# EAGLE design ATmega324 code loader (EAGLE 5.06)
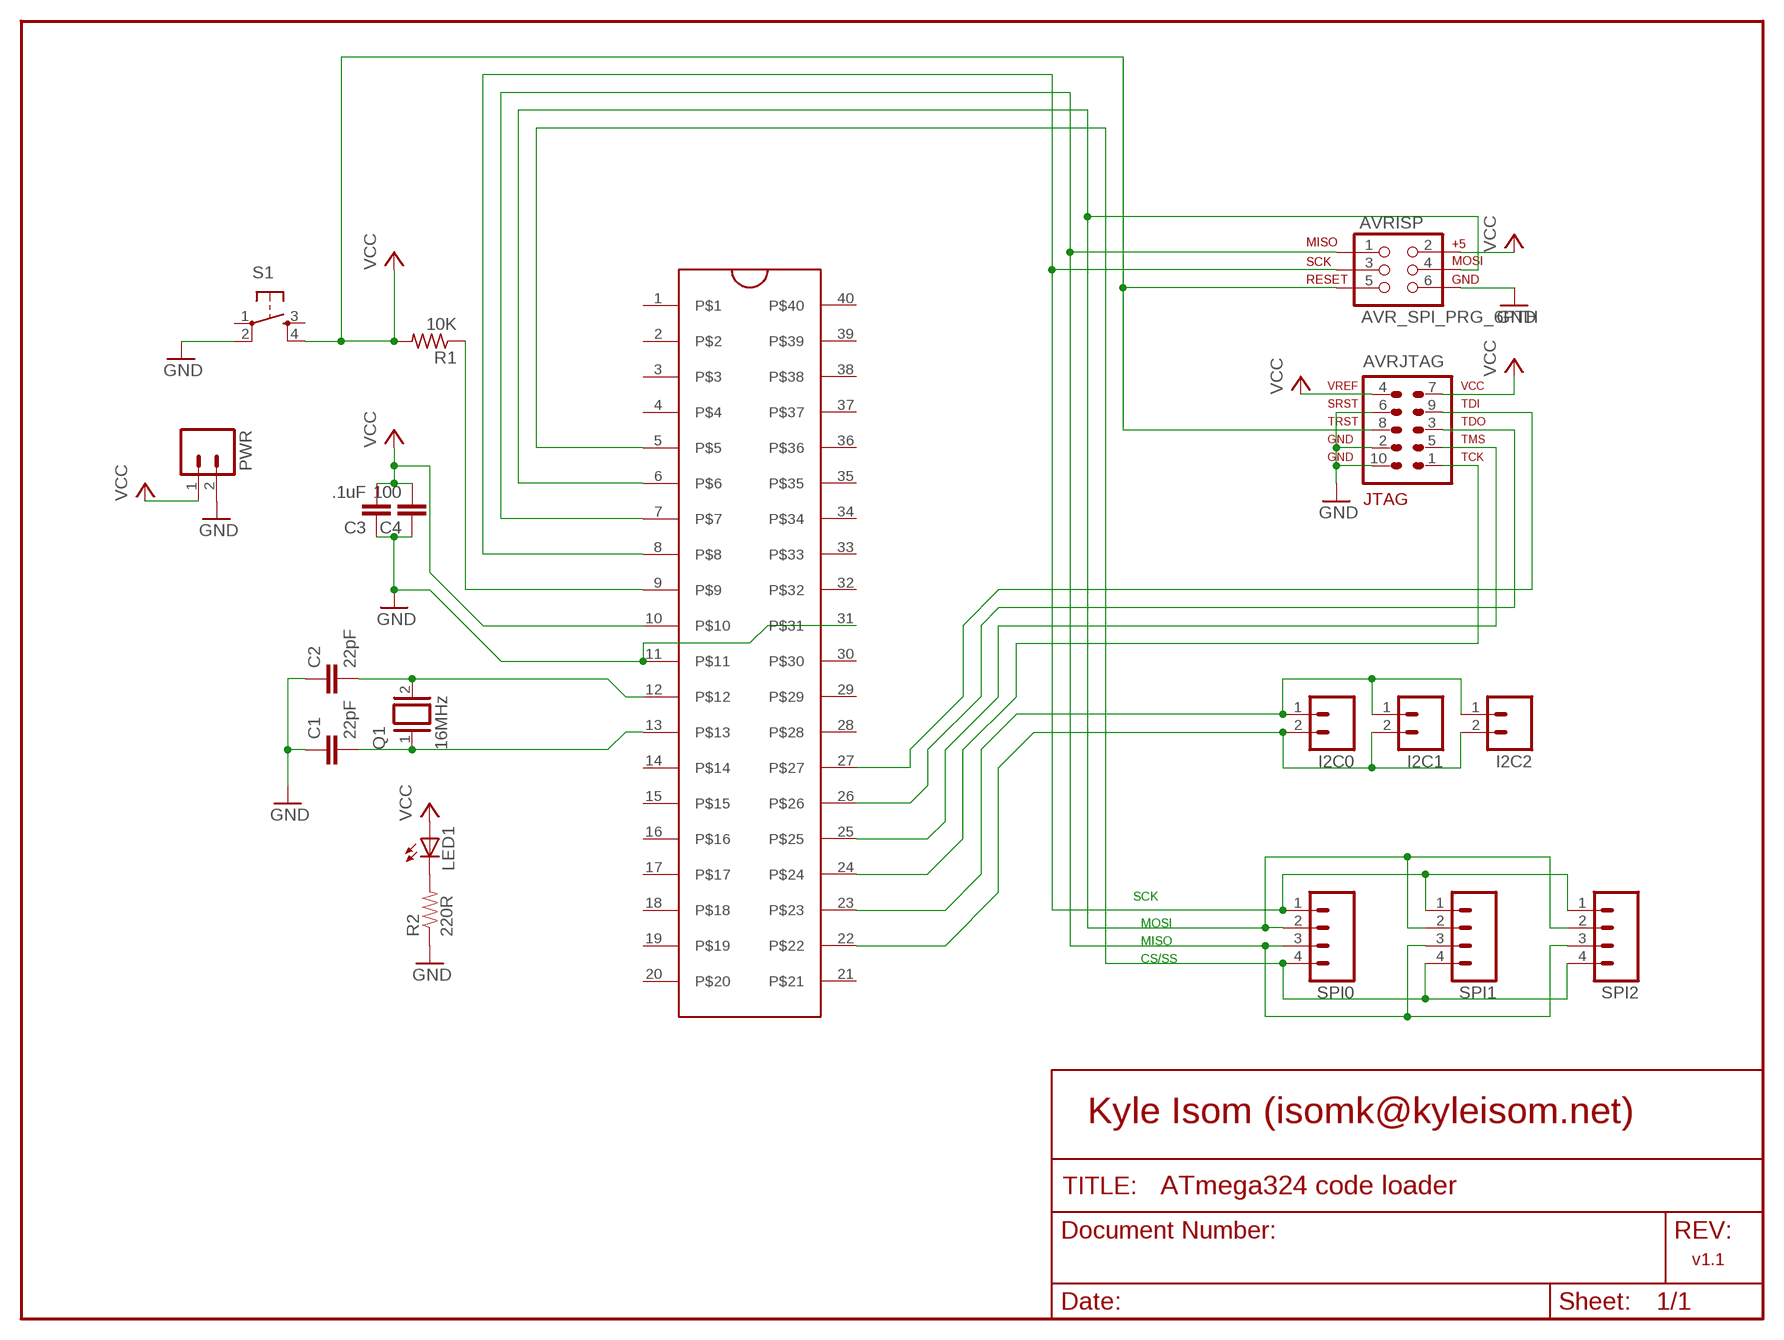
[diagram p0: schematic, sheet 1]

## Parts
ATMEGA164/324/644  ZIFSOCKET-40-6DIL40-6-ZIF_SOCKET  [DIL40-6-ZIF_SOCKET]
AVRISP  AVR_SPI_PRG_6PTH  [2X3]
AVRJTAG  AVR-JTAG-10  [AVR-JTAG-10]
C1  22pF  CAP0603-CAP  [0603-CAP]
C2  22pF  CAP0603-CAP  [0603-CAP]
C3  .1uF  CAP0603-CAP  [0603-CAP]
C4  100  CAP0603-CAP  [0603-CAP]
I2C0  M02LOCK  [1X02_LOCK]
I2C1  M02LOCK  [1X02_LOCK]
I2C2  M02LOCK  [1X02_LOCK]
LED1  LED0603  [LED-0603]
PWR  M02POLAR_LOCK  [MOLEX-1X2_LOCK]
Q1  16MHz  XTAL/S  [QS]
R1  10K  R-US_R0603  [R0603]
R2  220R  RESISTOR0603-RES  [0603-RES]
S1  TAC_SWITCHSMD  [TACTILE_SWITCH_SMD]
SPI0  M04LOCK  [1X04_LOCK]
SPI1  M04LOCK  [1X04_LOCK]
SPI2  M04LOCK  [1X04_LOCK]

## Nets
GND: ATMEGA164/324/644.11 ATMEGA164/324/644.31 AVRISP.6 AVRJTAG.2 AVRJTAG.6 AVRJTAG.10 C1.1 C2.1 C3.1 C4.1 PWR.2 R2.1 S1.2
N$1: ATMEGA164/324/644.12 C2.2 Q1.2
N$2: ATMEGA164/324/644.13 C1.2 Q1.1
N$3: ATMEGA164/324/644.25 AVRJTAG.5
N$4: LED1.C R2.2
N$6: ATMEGA164/324/644.9 R1.1
N$7: ATMEGA164/324/644.23 I2C0.1 I2C1.1 I2C2.1
N$8: ATMEGA164/324/644.22 I2C0.2 I2C1.2 I2C2.2
N$9: ATMEGA164/324/644.8 AVRISP.3 SPI0.1 SPI1.1 SPI2.1
N$10: ATMEGA164/324/644.6 AVRISP.4 SPI0.2 SPI1.2 SPI2.2
N$11: ATMEGA164/324/644.5 SPI0.4 SPI1.4 SPI2.4
N$12: ATMEGA164/324/644.7 AVRISP.1 SPI0.3 SPI1.3 SPI2.3
N$13: ATMEGA164/324/644.24 AVRJTAG.1
N$14: ATMEGA164/324/644.26 AVRJTAG.3
N$15: ATMEGA164/324/644.27 AVRJTAG.9
VCC: ATMEGA164/324/644.10 AVRISP.2 AVRISP.5 AVRJTAG.4 AVRJTAG.7 AVRJTAG.8 C3.2 C4.2 LED1.A PWR.1 R1.2 S1.4
Unconnected: ATMEGA164/324/644.1 ATMEGA164/324/644.2 ATMEGA164/324/644.3 ATMEGA164/324/644.4 ATMEGA164/324/644.14 ATMEGA164/324/644.15 ATMEGA164/324/644.16 ATMEGA164/324/644.17 ATMEGA164/324/644.18 ATMEGA164/324/644.19 ATMEGA164/324/644.20 ATMEGA164/324/644.21 ATMEGA164/324/644.28 ATMEGA164/324/644.29 ATMEGA164/324/644.30 ATMEGA164/324/644.32 ATMEGA164/324/644.33 ATMEGA164/324/644.34 ATMEGA164/324/644.35 ATMEGA164/324/644.36 ATMEGA164/324/644.37 ATMEGA164/324/644.38 ATMEGA164/324/644.39 ATMEGA164/324/644.40 S1.1 S1.3

## Notes on the sheet
- SCK
- MOSI
- MISO
- CS/SS
- Kyle Isom (isomk@kyleisom.net)
- v1.1

## Library data of the parts
ATMEGA164/324/644 = SparkFun:ZIFSOCKET-40-6
AVRISP = SparkFun:AVR_SPI_PRG_6: AVR ISP 6 Pin This is the reduced ISP connector for AVR programming. Common on Arduino. This footprint will take up less PCB space and can be used with a 10-pin to 6-pin adapter such as SKU: BOB-08508
AVRJTAG = avr-6:AVR-JTAG-10: AVR JTAG Debug/Programming Header
C1-C4 = SparkFun:CAP: Capacitor Standard 0603 ceramic capacitor, and 0.1" leaded capacitor.
I2C0 I2C1 I2C2 PWR = SparkFun:M02: Header 2 Standard 2-pin 0.1" header. Use with straight break away headers (SKU : PRT-00116), right angle break away headers (PRT-00553), swiss pins (PRT-00743), machine pins (PRT-00117), and female headers (PRT-00115). Molex polarized connector foot print use with SKU : PRT-08233 with associated crimp pins and housings.
LED1 = SparkFun:LED: LEDs Standard schematic elements and footprints for 5mm, 3mm, 1206, and 0603 sized LEDs. 5mm - Spark Fun Electronics SKU : COM-00529 (and others)
Q1 = special:XTAL/S: CRYSTAL
R1 = resistor:R-US_: RESISTOR, American symbol
R2 = SparkFun:RESISTOR: Resistor Basic schematic elements and footprints for 0603, 1206, and PTH 1/10th watt (small) resistors.
S1 = SparkFun:TAC_SWITCH: Momentary Switch Button commonly used for reset or general input. Spark Fun Electronics SKU : COM-00097
SPI0 SPI1 SPI2 = SparkFun:M04: Header 4 Standard 4-pin 0.1" header. Use with straight break away headers (SKU : PRT-00116), right angle break away headers (PRT-00553), swiss pins (PRT-00743), machine pins (PRT-00117), and female headers (PRT-00115). Molex polarized connector foot print use with SKU : PRT-08231 with associated crimp pins and housings.

## Board
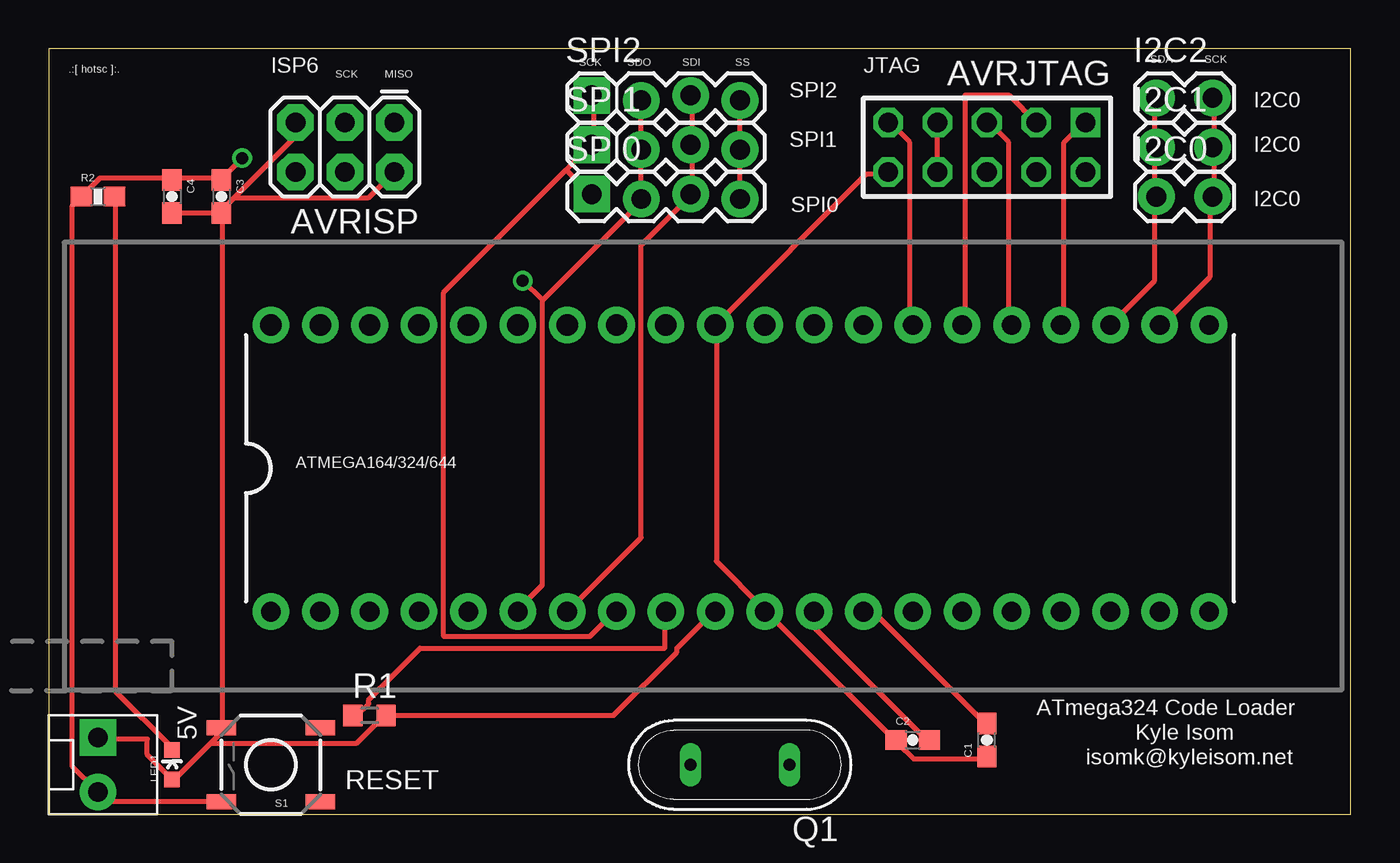
[diagram p1: board, top side]
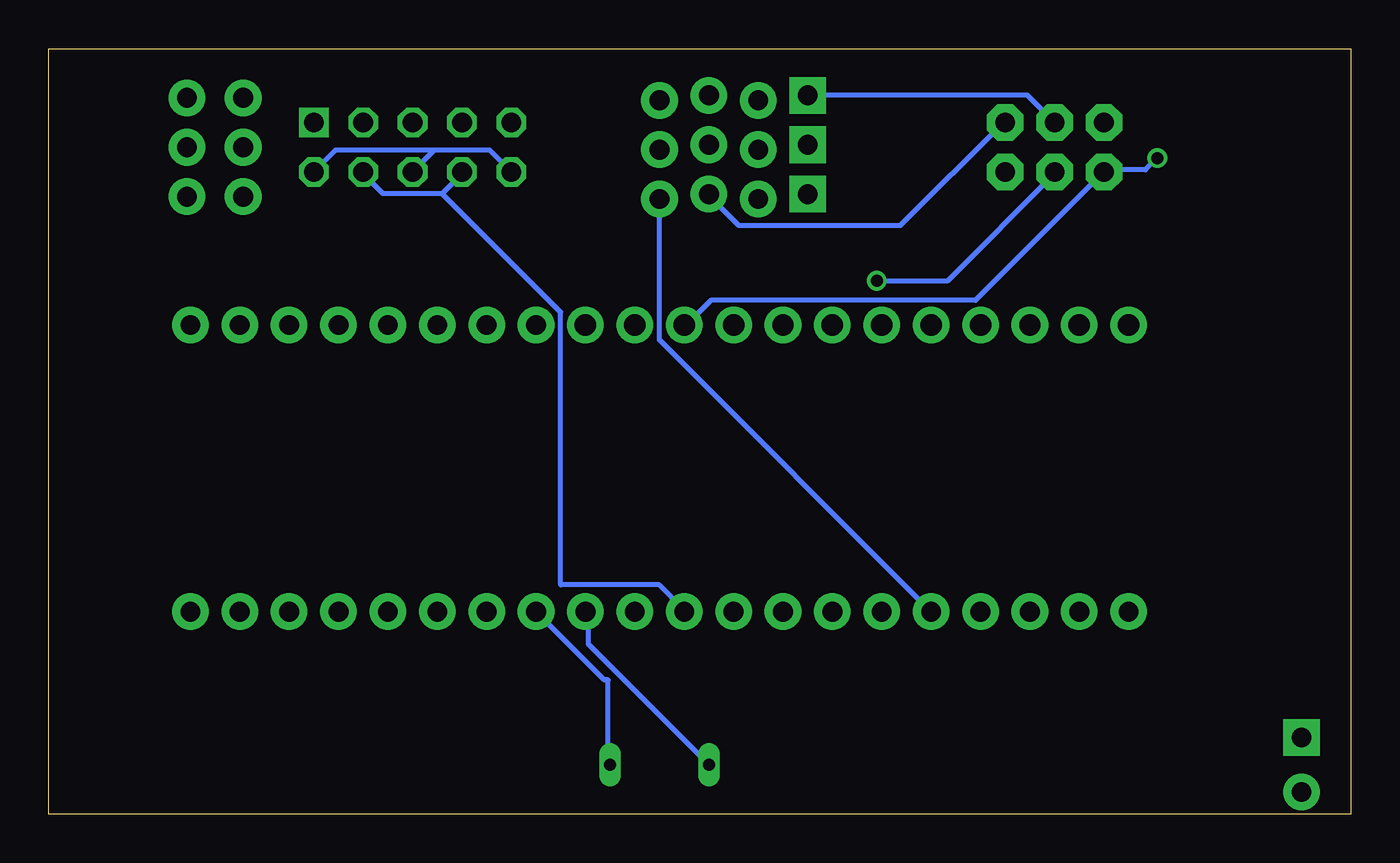
[diagram p2: board, bottom side, seen from below]

Size 66.98 x 39.36 mm. Coordinates in mm from the lower left corner, seen from the top.
Outline: 0,0 66.98,0 66.98,39.36 0,39.36 0,0
Copper layers (1*16): Top 0.035mm / dielectric 1.5mm / Bottom 0.035mm
Design rules "default": minimum track width 10mil, minimum drill 24mil, track to track 8mil, track to pad 8mil, pad to pad 8mil, via to via 8mil, smd to smd 8mil, copper to edge 40mil, drill to drill 8mil, minimum pad ring 10mil, minimum via ring 8mil, stop-mask expansion 4mil, vias tented up to drill 0mil, thermal gap 10mil

### Footprints (pad centres in the part's own frame; a part is rotated, then mirrored left to right if it is on the bottom)
DIL40-6-ZIF_SOCKET = drill 1.016 pad 1.88 round: 1 -24.13,-7.366; 2 -21.59,-7.366; 3 -19.05,-7.366; 4 -16.51,-7.366; 5 -13.97,-7.366; 6 -11.43,-7.366; 7 -8.89,-7.366; 8 -6.35,-7.366; 9 -3.81,-7.366; 10 -1.27,-7.366; 11 1.27,-7.366; 12 3.81,-7.366; 13 6.35,-7.366; 14 8.89,-7.366; 15 11.43,-7.366; 16 13.97,-7.366; 17 16.51,-7.366; 18 19.05,-7.366; 19 21.59,-7.366; 20 24.13,-7.366; 21 24.13,7.366; 22 21.59,7.366; 23 19.05,7.366; 24 16.51,7.366; 25 13.97,7.366; 26 11.43,7.366; 27 8.89,7.366; 28 6.35,7.366 | drill 1.1 pad 1.88 round: 29 3.81,7.366; 30 1.27,7.366; 31 -1.27,7.366; 32 -3.81,7.366; 33 -6.35,7.366; 34 -8.89,7.366; 35 -11.43,7.366; 36 -13.97,7.366; 37 -16.51,7.366; 38 -19.05,7.366; 39 -21.59,7.366; 40 -24.13,7.366
2X3 = drill 1.016 pad 1.88 octagon: 1 0,0; 2 0,2.54; 3 2.54,0; 4 2.54,2.54; 5 5.08,0; 6 5.08,2.54
AVR-JTAG-10 = drill 1.016 square: 1 -5.08,-1.27 | drill 1.016 octagon: 2 -5.08,1.27; 3 -2.54,-1.27; 4 -2.54,1.27; 5 0,-1.27; 6 0,1.27; 7 2.54,-1.27; 8 2.54,1.27; 9 5.08,-1.27; 10 5.08,1.27
0603-CAP = smd 1.1 x 1: 1 -0.85,0; 2 0.85,0
1X02_LOCK = drill 1.016 pad 1.88 round: 1 -0.178,0; 2 2.718,0
LED-0603 = smd 0.8 x 0.8: A 0,-0.75; C 0,0.75
MOLEX-1X2_LOCK = drill 1.016 pad 1.88 square: 1 -0.127,0 | drill 1.016 pad 1.88 round: 2 2.667,0
QS = drill 0.61 long: 1 -2.54,0; 2 2.54,0
R0603 = smd 1 x 1.1: 1 -0.85,0; 2 0.85,0
0603-RES = smd 1.1 x 1: 1 -0.85,0; 2 0.85,0
TACTILE_SWITCH_SMD = smd 1.524 x 0.762: 1 -2.54,1.905; 2 2.54,1.905; 3 -2.54,-1.905; 4 2.54,-1.905
1X04_LOCK = drill 1.016 pad 1.88 square: 1 0,0.127 | drill 1.016 pad 1.88 round: 2 2.54,-0.127; 3 5.08,0.127; 4 7.62,-0.127

### Placement (x,y rotation side)
ATMEGA164/324/644  35.56,17.78 0 top
AVRISP  17.78,35.56 180 top
AVRJTAG  48.26,34.29 180 top
C1  48.26,3.81 90 top
C2  44.45,3.81 0 top
C3  8.89,31.75 270 top
C4  6.35,31.75 270 top
I2C0  57.15,31.75 0 top
I2C1  57.15,34.29 0 top
I2C2  57.15,36.83 0 top
LED1  6.35,2.54 0 top
PWR  2.54,3.81 270 top
Q1  35.56,2.54 180 top
R1  16.51,5.08 0 top
R2  2.54,31.75 0 top
S1  11.43,2.54 180 top
SPI0  27.94,31.75 0 top
SPI1  27.94,34.29 0 top
SPI2  27.94,36.83 0 top

### Tracks (layer width: path | path; a pad name or v marks a point on that pad's centre or on a via)
GND  (via drill 0.61)
  Top 0.254: C1.1 48.16,2.85 44.5,2.85 43.69,3.66 C2.1 43.48,3.86 36.98,10.36 ATMEGA164/324/644.11 36.78,10.57 34.34,13.01 34.34,24.99 ATMEGA164/324/644.31 42.06,32.92 43.08,32.92 AVRJTAG.10 | v9.96,33.73 8.94,32.72 C3.1 8.74,32.72 6.5,32.72 C4.1 6.3,32.72 2.64,32.72 1.83,31.9 R2.1 1.63,31.7 1.22,31.29 1.22,2.44 2.44,1.22 PWR.2 2.54,0.64 S1.2
  Bottom 0.254: 47.14,34.14 44.3,34.14 AVRJTAG.10 | 47.14,34.14 AVRJTAG.6 | 47.14,34.14 52.22,34.14 AVRJTAG.2 | ATMEGA164/324/644.31 34.14,25.2 32.92,26.42 19.3,26.42 AVRISP.6 12.6,33.12 10.57,33.12 v9.96,33.73
N$1
  Top 0.254: C2.2 45.11,3.86 39.42,9.55 39.42,10.36 ATMEGA164/324/644.12
  Bottom 0.254: Q1.2 39.22,8.74 39.22,10.36 ATMEGA164/324/644.12
N$2
  Top 0.254: C1.2 48.16,4.67 42.47,10.36 42.06,10.36 ATMEGA164/324/644.13
  Bottom 0.254: Q1.1 38.2,2.64 38.2,6.91 38.41,6.91 ATMEGA164/324/644.13
N$3
  Top 0.254: AVRJTAG.5 48.36,35.56 49.38,34.54 49.38,25.2 ATMEGA164/324/644.25
N$4
  Top 0.254: LED1.C 6.3,3.45 3.45,6.3 3.45,31.7 R2.2
N$6
  Top 0.254: R1.1 15.85,5.08 16.46,5.69 16.46,5.89 19.1,8.53 31.7,8.53 31.7,10.36 ATMEGA164/324/644.9
N$7
  Top 0.254: ATMEGA164/324/644.23 56.9,27.43 56.9,31.7 I2C0.1 56.9,31.9 56.9,34.14 I2C1.1 56.9,34.34 56.9,36.78 I2C2.1
N$8
  Top 0.254: ATMEGA164/324/644.22 57.3,25.2 59.74,27.64 59.74,31.7 I2C0.2 59.94,31.9 59.94,34.14 I2C1.2 59.94,34.34 59.94,36.78 I2C2.2
N$9
  Top 0.254: 26.62,33.12 27.84,34.34 SPI1.1 28.04,34.54 28.04,36.78 SPI2.1 | 26.62,33.12 20.32,26.82 20.32,9.14 27.84,9.14 29.06,10.36 ATMEGA164/324/644.8 | 26.62,33.12 27.84,31.9 SPI0.1
  Bottom 0.254: AVRISP.3 16.66,36.98 27.84,36.98 SPI2.1
N$10  (via drill 0.61)
  Top 0.254: SPI2.2 SPI1.2 SPI0.2 30.48,31.5 25.4,26.42 | 25.4,26.42 25.4,11.79 24.18,10.57 ATMEGA164/324/644.6 | 25.4,26.42 v24.38,27.43
  Bottom 0.254: v24.38,27.43 20.73,27.43 15.24,32.92 AVRISP.4
N$11
  Top 0.254: SPI2.4 SPI1.4 SPI0.4
  Bottom 0.254: ATMEGA164/324/644.5 35.56,24.38 SPI0.4
N$12
  Top 0.254: SPI2.3 33.12,36.78 33.12,34.54 SPI1.3 33.12,34.34 33.12,31.9 SPI0.3 32.92,31.7 30.48,29.26 30.48,14.22 ATMEGA164/324/644.7
  Bottom 0.254: AVRISP.1 17.88,35.56 23.16,30.28 31.5,30.28 32.92,31.7 SPI0.3
N$13
  Top 0.254: AVRJTAG.1 53.24,35.56 52.22,34.54 52.22,25.2 ATMEGA164/324/644.24
N$14
  Top 0.254: AVRJTAG.3 49.38,36.98 47.14,36.98 47.14,25.2 ATMEGA164/324/644.26
N$15
  Top 0.254: AVRJTAG.9 43.28,35.56 44.3,34.54 44.3,25.2 ATMEGA164/324/644.27
VCC
  Top 0.254: C4.2 6.5,30.89 8.74,30.89 C3.2 | 9.55,31.7 12.6,34.75 12.6,35.56 AVRISP.5 | 9.55,31.7 8.94,31.09 C3.2 | 9.55,31.7 16.46,31.7 AVRISP.2 | AVRJTAG.8 AVRJTAG.7 | 8.33,3.66 8.74,4.06 8.74,4.27 S1.4 8.94,4.47 8.94,30.89 C3.2 | 8.33,3.66 6.5,1.83 LED1.A 6.3,1.83 5.08,3.05 5.08,3.86 2.64,3.86 PWR.1 | 8.33,3.66 15.85,3.66 17.27,5.08 R1.2 29.06,5.08 32.31,8.33 32.31,8.53 34.14,10.36 ATMEGA164/324/644.10
  Bottom 0.254: 46.74,31.9 49.78,31.9 50.8,32.92 AVRJTAG.4 | 46.74,31.9 45.72,32.92 AVRJTAG.8 | 46.74,31.9 40.64,25.81 40.64,11.79 35.56,11.79 34.34,10.57 ATMEGA164/324/644.10

### Text on the board
tPlace: SCK | SDO | SDI | SS | SDA | SCK | .:[ hotsc ]:. | ISP6 | SCK | MISO | JTAG | SPI2 | I2C0 | SPI1 | I2C0 | SPI0 | I2C0 | ATmega324 Code Loader | 5V | Kyle Isom | isomk@kyleisom.net | RESET